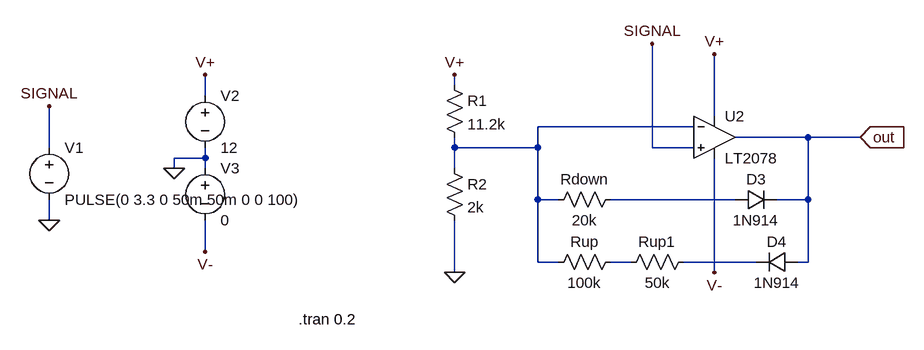
[diagram p0: schematic hysteresis.asc]
hysteresis.asc, the LTspice schematic file:
Version 4
SHEET 1 880 916
WIRE -256 112 -256 96
WIRE -640 128 -640 96
WIRE 144 160 144 64
WIRE 112 176 -128 176
WIRE 288 192 176 192
WIRE 368 192 288 192
WIRE -880 208 -880 144
WIRE -256 208 -256 192
WIRE -128 208 -128 176
WIRE -128 208 -256 208
WIRE 48 208 48 48
WIRE 112 208 48 208
WIRE -640 224 -640 208
WIRE -640 224 -688 224
WIRE -688 240 -688 224
WIRE -640 240 -640 224
WIRE -256 240 -256 208
WIRE -128 288 -128 208
WIRE -96 288 -128 288
WIRE 176 288 -16 288
WIRE 288 288 288 192
WIRE 288 288 240 288
WIRE -880 320 -880 288
WIRE -640 368 -640 320
WIRE -128 384 -128 288
WIRE -96 384 -128 384
WIRE 16 384 -16 384
WIRE 208 384 96 384
WIRE 288 384 288 288
WIRE 288 384 272 384
WIRE -256 400 -256 320
WIRE 144 400 144 224
FLAG -688 240 0
FLAG -640 96 V+
FLAG 144 64 V+
FLAG -640 368 V-
FLAG 144 400 V-
FLAG -880 144 SIGNAL
FLAG -880 320 0
FLAG 368 192 out
IOPIN 368 192 In
FLAG 48 48 SIGNAL
FLAG -256 400 0
FLAG -256 96 V+
SYMBOL voltage -880 192 R0
WINDOW 123 0 0 Left 2
WINDOW 39 0 0 Left 2
SYMATTR InstName V1
SYMATTR Value PULSE(0 3.3 0 50m 50m 0 0 100)
SYMBOL voltage -640 112 R0
WINDOW 123 0 0 Left 2
WINDOW 39 0 0 Left 2
SYMATTR InstName V2
SYMATTR Value 12
SYMBOL voltage -640 224 R0
WINDOW 123 0 0 Left 2
WINDOW 39 0 0 Left 2
SYMATTR InstName V3
SYMATTR Value 0
SYMBOL res -272 96 R0
SYMATTR InstName R1
SYMATTR Value 11.2k
SYMBOL res -272 224 R0
SYMATTR InstName R2
SYMATTR Value 2k
SYMBOL res 0 272 R90
WINDOW 0 0 56 VBottom 2
WINDOW 3 32 56 VTop 2
SYMATTR InstName Rdown
SYMATTR Value 20k
SYMBOL res 0 368 R90
WINDOW 0 0 56 VBottom 2
WINDOW 3 32 56 VTop 2
SYMATTR InstName Rup
SYMATTR Value 100k
SYMBOL Opamps\\LT2078 144 128 R0
SYMATTR InstName U2
SYMBOL diode 176 304 R270
WINDOW 0 32 32 VTop 2
WINDOW 3 0 32 VBottom 2
SYMATTR InstName D3
SYMATTR Value 1N914
SYMBOL diode 272 368 R90
WINDOW 0 0 32 VBottom 2
WINDOW 3 32 32 VTop 2
SYMATTR InstName D4
SYMATTR Value 1N914
SYMBOL res 112 368 R90
WINDOW 0 0 56 VBottom 2
WINDOW 3 32 56 VTop 2
SYMATTR InstName Rup1
SYMATTR Value 50k
TEXT -496 472 Left 2 !.tran 0.2

The netlist it stands for:
* hysteresis.asc
V1 SIGNAL 0 PULSE(0 3.3 0 50m 50m 0 0 100)
V2 V+ 0 12
V3 0 V- 0
R1 V+ N001 11.2k
R2 N001 0 2k
Rdown N002 N001 20k
Rup N003 N001 100k
XU2 SIGNAL N001 V+ V- out LT2078  ; pins In+ In- V+ V- OUT
D3 N002 out 1N914
D4 out N004 1N914
Rup1 N004 N003 50k
.model D D
.lib standard.dio
.tran 0.2
.backanno
.end